# EAGLE board SDA390V1 (EAGLE 9.6.2), part 1 of 5
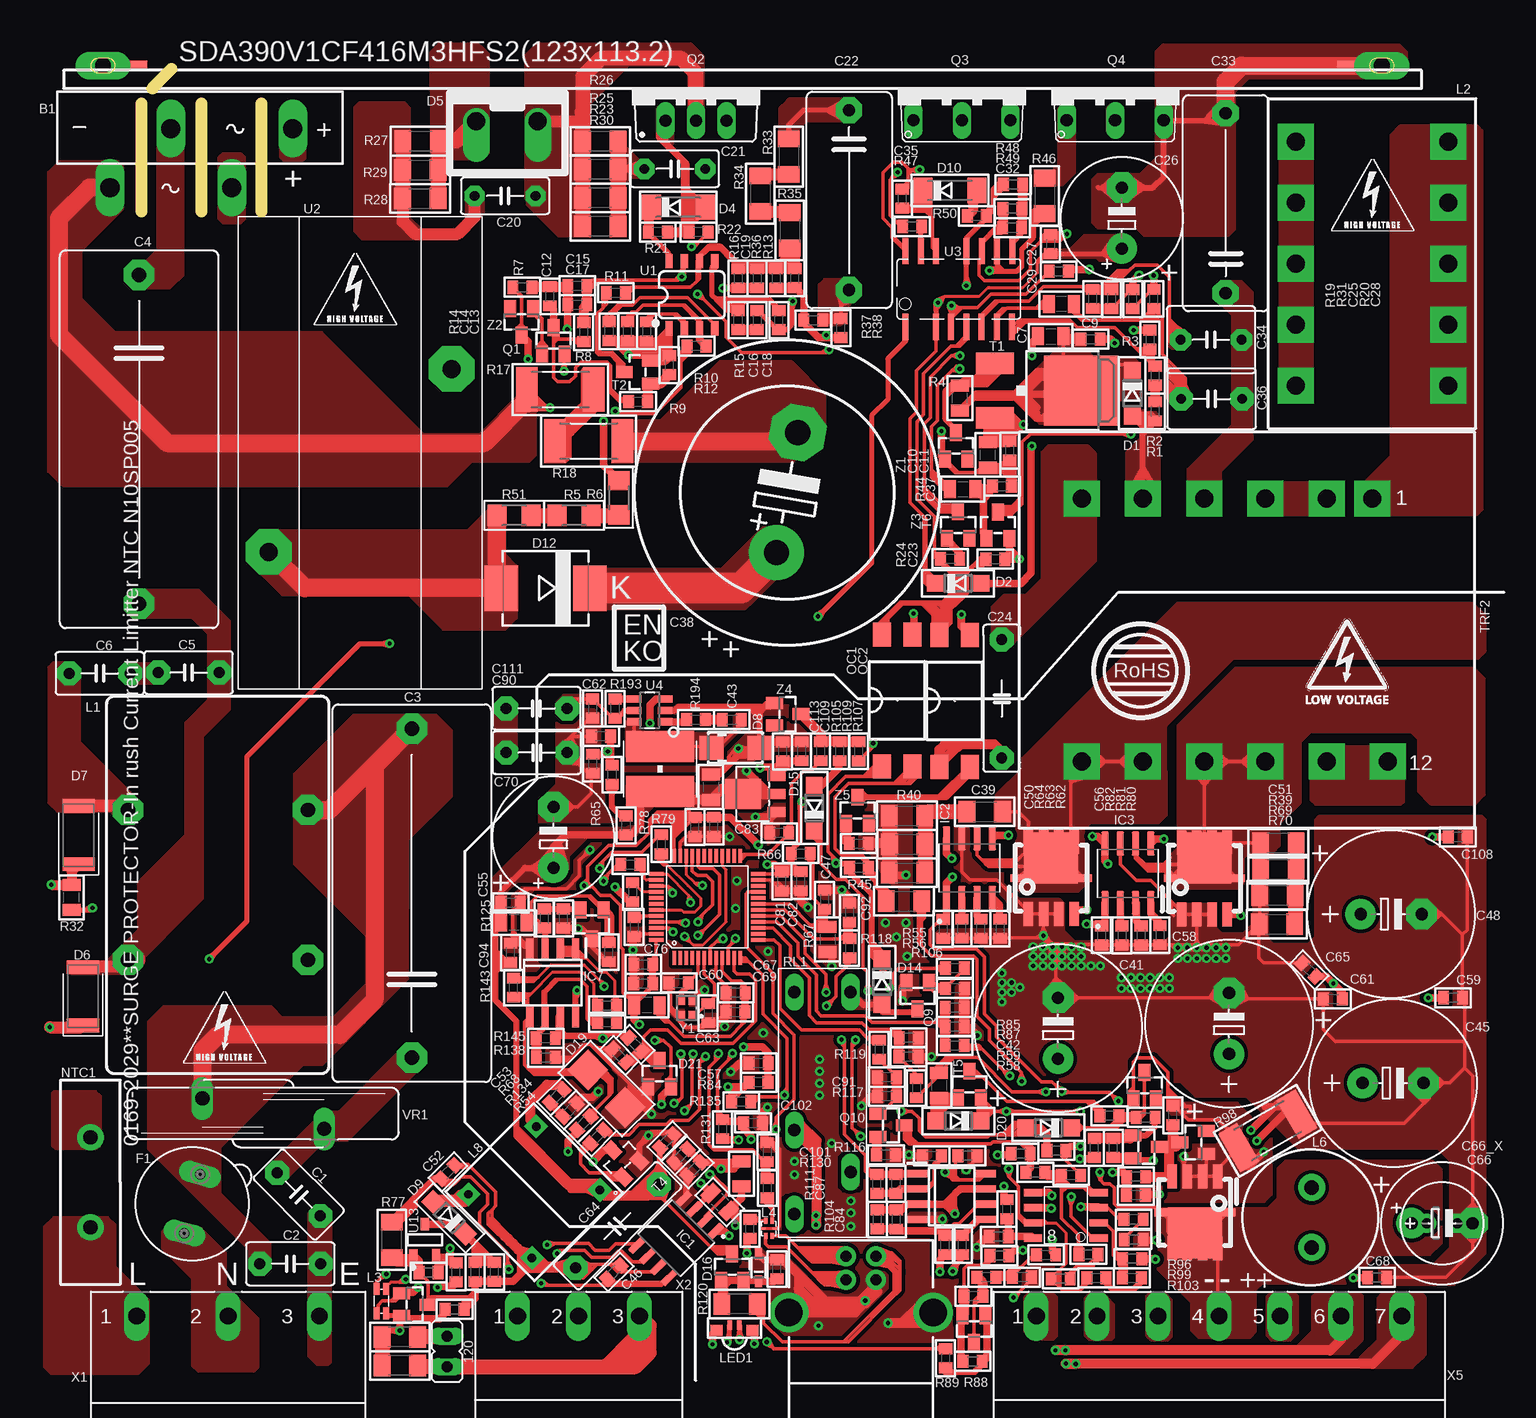
[diagram p5: board, top side]
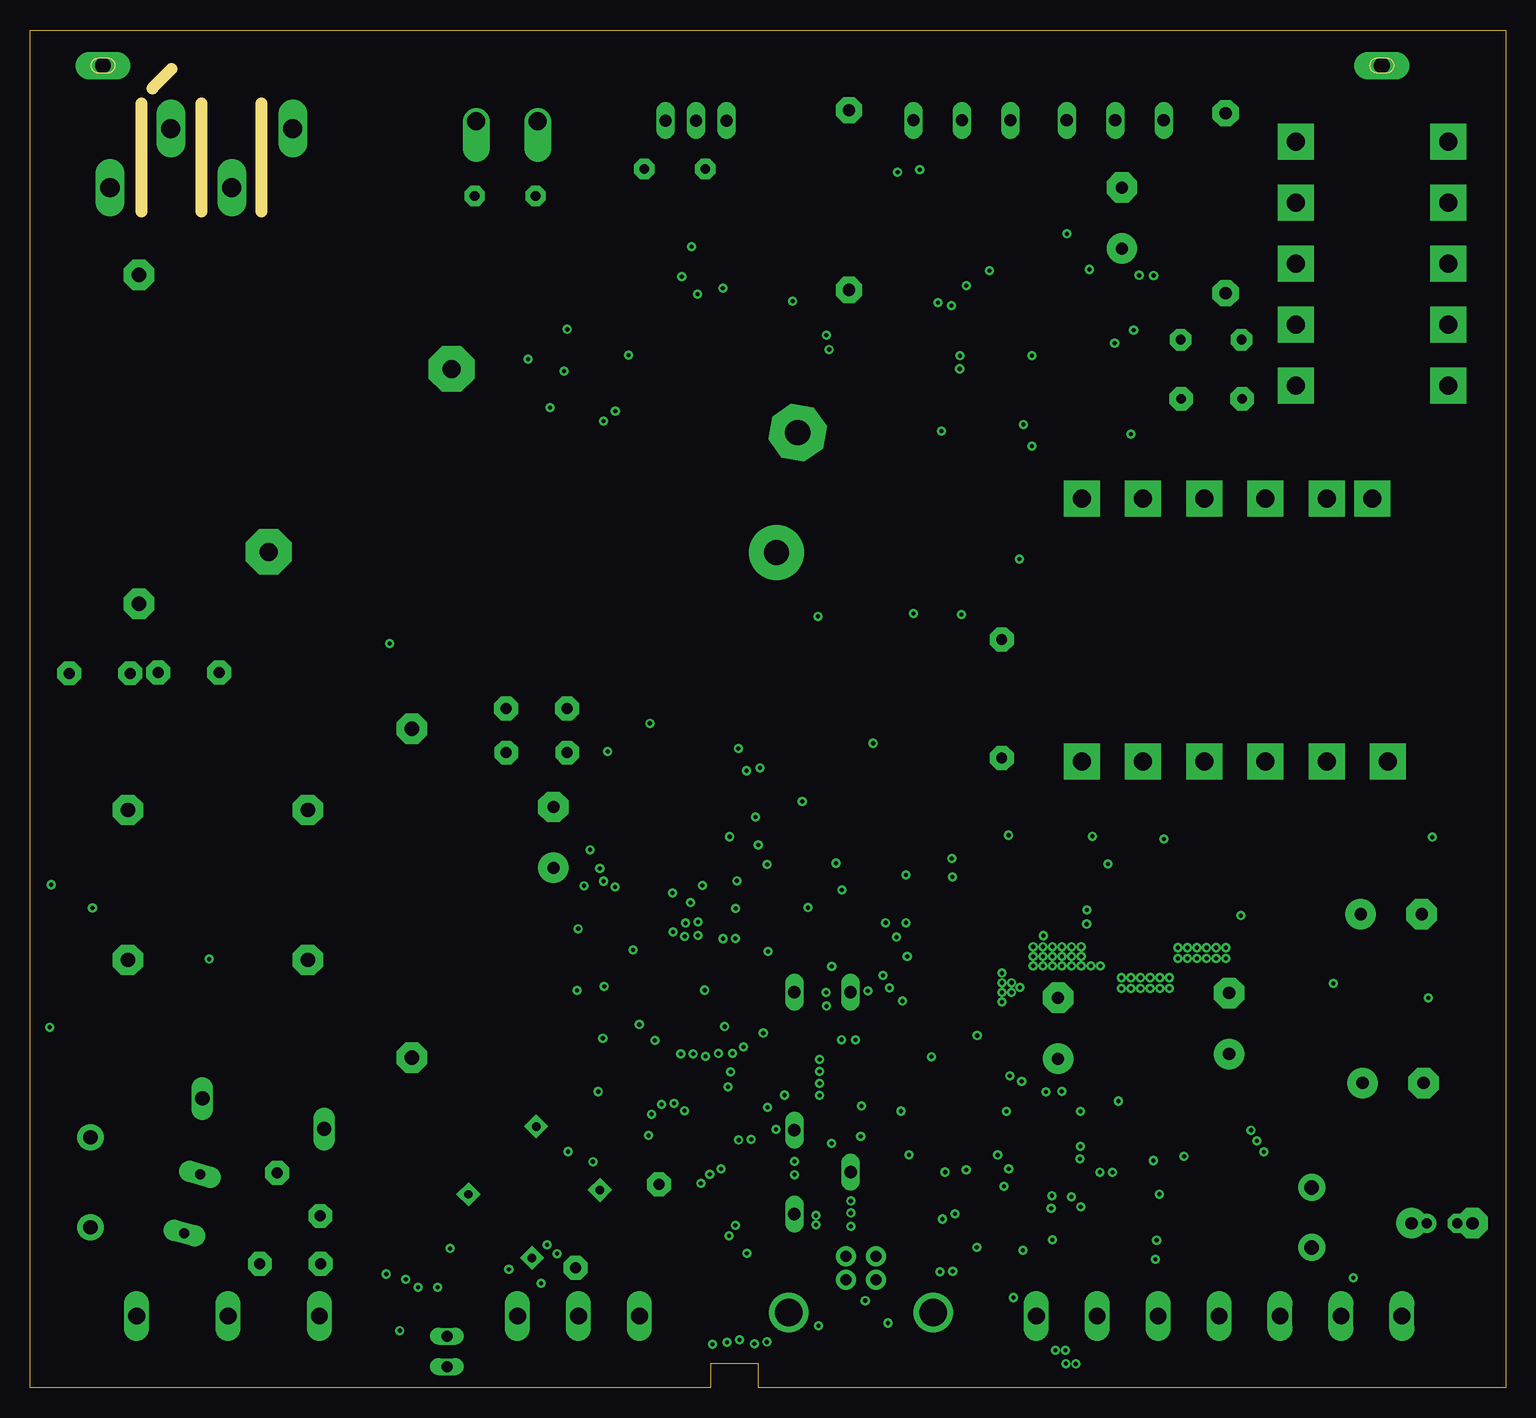
[diagram p6: board, inner layer Route3]
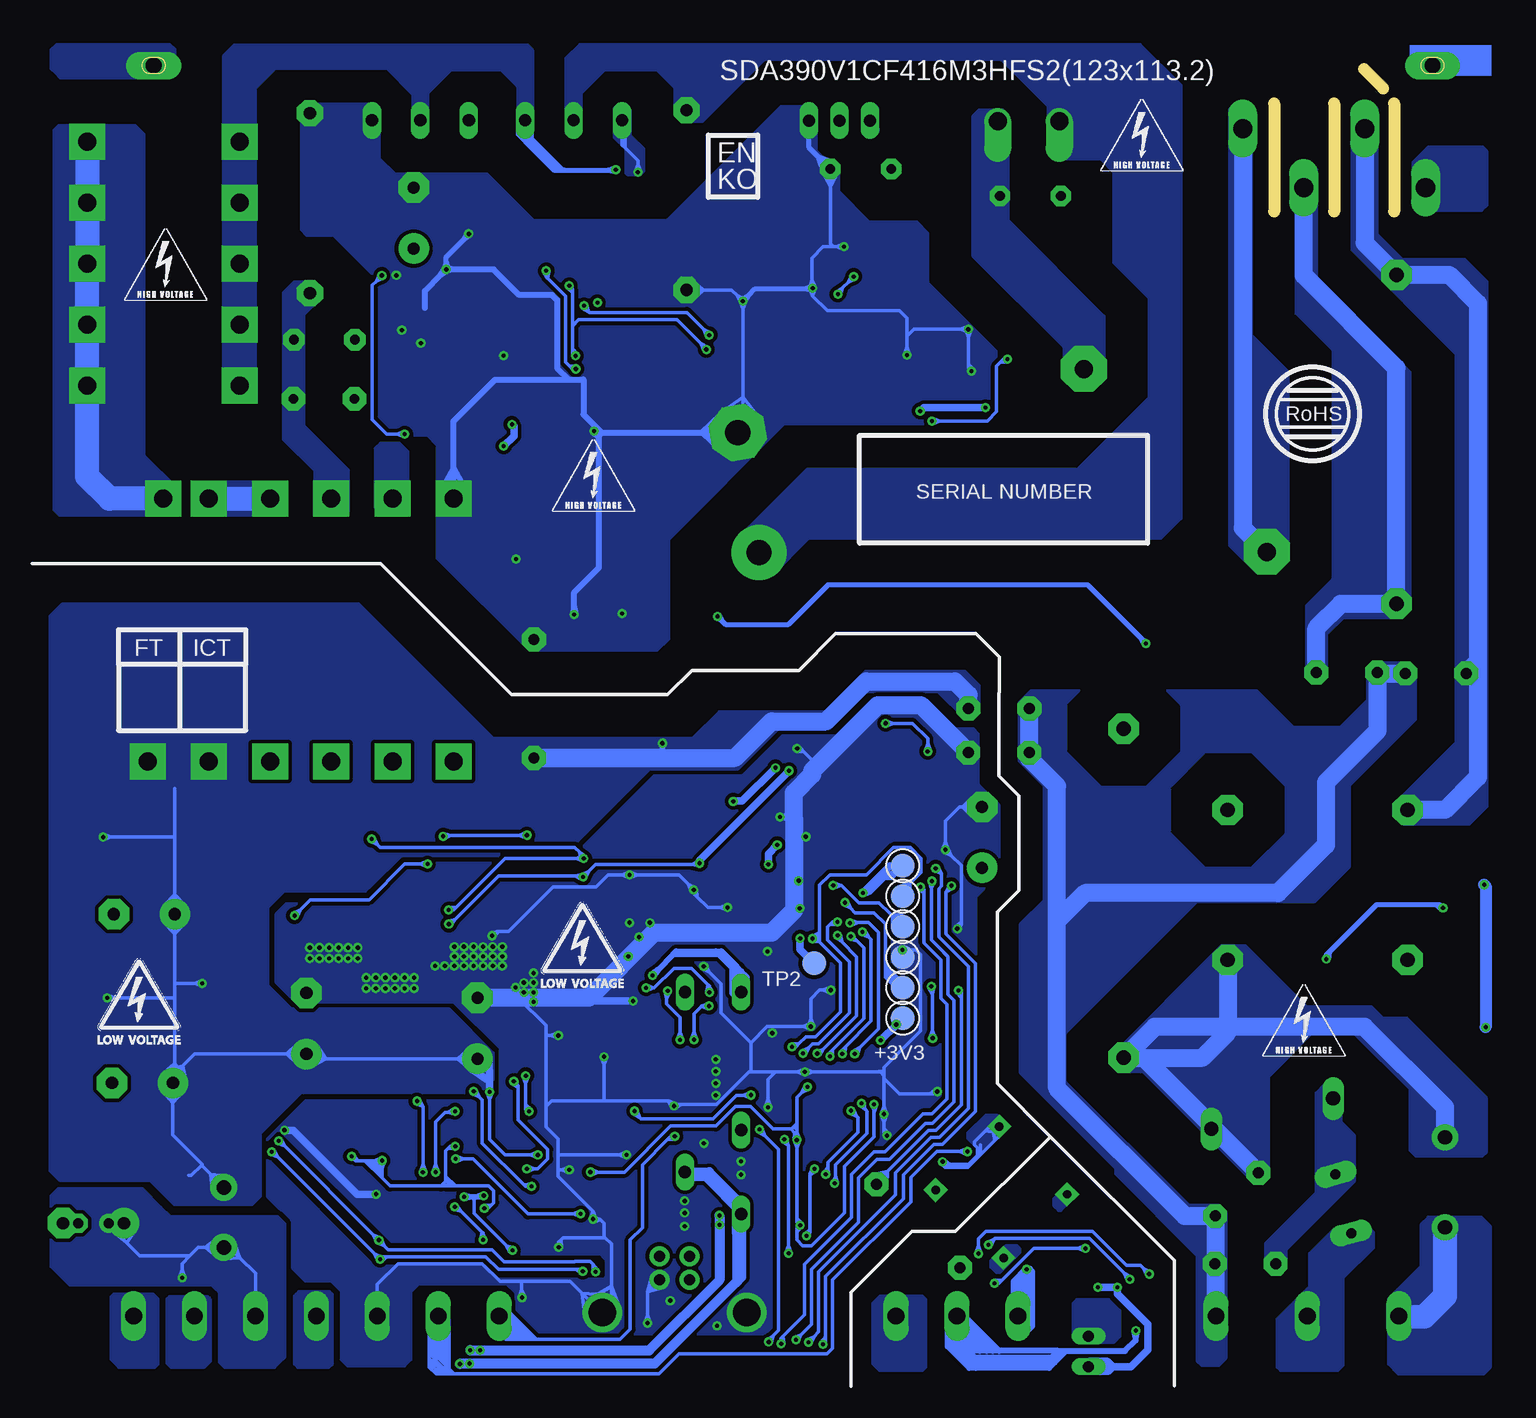
[diagram p7: board, bottom side, seen from below]

No outline drawn. Coordinates in mm, seen from the top.
Copper layers (1*3*16): Top 0.035mm / dielectric 1.53mm / Route3 0mil / dielectric 0mil / Bottom 0.035mm
Design rules "default *": minimum track width 6mil, minimum drill 0.35mm, track to track 11mil, track to pad 11mil, pad to pad 11mil, via to via 11mil, smd to smd 11mil, copper to edge 40mil, drill to drill 6mil, minimum pad ring 10mil, minimum via ring 8mil, stop-mask expansion 4mil, vias tented up to drill 0.35mm, thermal gap 10mil
Milling: 1 lines

## Footprints (pad centres in the part's own frame; a part is rotated, then mirrored left to right if it is on the bottom)
DıODE_BRIDGE_8A_DIK = drill 1.6 long: + -7.62,0.08; - 7.62,5; AC1 -2.54,5; AC2 2.54,0.08
C050-035X075 = drill 0.914 pad 1.981 octagon: 1 -2.54,0; 2 2.54,0
C275-134X316 = drill 1.194 pad 2.54 octagon: 1 -13.716,0; 2 13.716,0
C0805_ENKO = smd 1 x 1.5: 1 -1.052,0; 2 1.052,0
C0603_ENKO = smd 0.9 x 1.1: 1 -0.794,0; 2 0.794,0
C050-030X075 = drill 0.813 pad 1.676 octagon: 1 -2.54,0; 2 2.54,0
C150-072X183 = drill 1.016 pad 2.184 octagon: 1 -7.493,0; 2 7.493,0
C075-32X103_DEIF = drill 0.914 pad 2 octagon: P$1 -4.92,0; P$2 4.92,0
E5-10,5 = drill 1.016 pad 2.54: + -2.54,0 | drill 1.016 pad 2.54 octagon: - 2.54,0
C050-055X075 = drill 0.813 pad 1.778 octagon: 1 -2.54,0; 2 2.54,0
C050-050X075 = drill 0.813 pad 1.93 octagon: 1 -2.54,0; 2 2.54,0
EB25D = drill 2.1 pad 4.597: + -5.08,0 | drill 2.1 pad 4.597 octagon: - 5.08,0
C1206_ENKO = smd 1.4 x 1.8: 1 -1.479,0; 2 1.479,0
E5-13 = drill 1.016 pad 2.54: + -2.54,0 | drill 1.016 pad 2.54 octagon: - 2.54,0
E2,5-7 = drill 0.813 pad 1.6: + -1.27,0 | drill 0.813 pad 1.6 octagon: - 1.27,0
SOD123 = smd 1.4 x 1.4: A 1.9,0; C -1.9,0
SOT23 = smd 1 x 1.4: 1 -0.95,-1.1; 2 0.95,-1.1; 3 0,1.1
SOD106-R = smd 1.6 x 2.1: A 2.25,0; C -2.25,0
DIODE_12A_1000V_TO220 = drill 1.5 pad 2.184 offset: A 1.27,-2.54; K 1.27,2.59
DIOMELF5024 = smd 1.156 x 2.69: 1 -2.43,0; 2 2.43,0
SMA = smd 2 x 2: A 2,0; C -2,0
SMC = smd 2.8 x 3.8: A 3.7,0; C -3.7,0
TRANSIL_SMB = smd 2.4 x 2.4: A 2.2,0; A1 -2.2,0
19560 = drill 0.813 pad 1.778 long: 1 -2.54,0; 2 2.54,0
FERRITE_BEAT_0805 = smd 1 x 1.5: 1 -1.052,0; 2 1.052,0
DEIF_SOGUTUCU_300W = drill 1.3 pad 2.3 long: 1 -54.49,1.15; 3 52.11,1.15 | smd 4.3 x 0.8: 2 -52.94,1.15; 4 50.56,1.15
ISO1044 = smd 1.55 x 0.59: 1 -2.725,1.905; 2 -2.725,0.635; 3 -2.725,-0.635; 4 -2.725,-1.905; 5 2.725,-1.905; 6 2.725,-0.635; 7 2.725,0.635; 8 2.725,1.905
NCP4306 = smd 1.97 x 0.6: 1 -2.475,1.905; 2 -2.475,0.635; 3 -2.475,-0.635; 4 -2.475,-1.905; 5 2.475,-1.905; 6 2.475,-0.635; 7 2.475,0.635; 8 2.475,1.905
SO-8 = smd 1.524 x 0.61: 1 -2.743,1.92; 2 -2.743,0.65; 3 -2.743,-0.62; 4 -2.743,-1.89; 5 2.743,-1.89; 6 2.743,-0.62; 7 2.743,0.65; 8 2.743,1.92
SO08 = smd 0.6 x 1.8: 1 -1.905,-2.8; 2 -0.635,-2.8; 3 0.635,-2.8; 4 1.905,-2.8; 5 1.905,2.8; 6 0.635,2.8; 7 -0.635,2.8; 8 -1.905,2.8
TL431_SOT23F = smd 1 x 1.4: A 0,1.2; C -0.95,-1.2; R 0.95,-1.2
TPH6R30ANL = smd 0.8 x 2: D 1.905,3; D1 0.635,3; D2 -0.635,3; D3 -1.905,3; GATE 1.905,-3; S -1.905,-3; S1 -0.635,-3; S2 0.635,-3 | smd 1.27 x 0.635: P$1 -2.75,0; P$2 2.75,0 | smd 4.5 x 4.25: P$3 0,1.7
SOT89 = smd 0.8 x 1.5: 1 -1.5,-1.75; 2 0,-1.75; 3 1.5,-1.75 | smd 2.5 x 3: 4 0,1.05
JP1 = drill 0.914 long: 1 0,-1.27; 2 0,1.27
EPCOS_B82724J = drill 1.2 pad 2.54 octagon: 1 -7.5,-6.25; 2 -7.5,6.25; 3 7.5,6.25; 4 7.5,-6.25
E25/13/7 = drill 1.5 pad 3 square: 1 -6.35,10.16; 2 -6.35,5.08; 3 -6.35,0; 4 -6.35,-5.08; 5 -6.35,-10.16; 6 6.35,-10.16; 7 6.35,-5.08; 8 6.35,0; 9 6.35,5.08; 10 6.35,10.16
ACM2012-900--2P-T002 = smd 1 x 0.5: 1 -1.02,0.4; 2 -1.02,-0.4; 3 1.02,-0.4; 4 1.02,0.4
EXC24CS_COMMON_MODE = smd 0.4 x 0.2: 1 -0.5,0; 4 0.5,0 | smd 0.3 x 0.5: 2 -0.275,-0.625; 3 0.275,-0.625; 5 0.275,0.625; 6 -0.275,0.625
WE-PD2_5MM = smd 2.55 x 5.7: 1 -1.875,0; 2 1.875,0
INDUCTOR-NEOSID = drill 1.2 pad 2.25: 1 -2.5,0.1; 2 2.5,0.1
EE10_V_4+4 = drill 0.7 pad 1.422 square: 1 -4,3.75; 4 -4,-3.75; 5 4,-3.75; 8 4,3.75
KPFA-3010RGBC-11 = smd 1 x 0.9: 1 1.5,-0.2; 2 -1.5,-0.2 | smd 0.4 x 0.8: 3 -0.4,0.25; 4 0.4,0.25
SENS_NTC = drill 1.2 pad 2.184: P$1 3.75,0; P$2 -3.75,0
PS2561DL2-1_OPTO1 = smd 1.5 x 2: 1 -1.27,-5.5; 2 1.27,-5.5; 3 1.27,5.5; 4 -1.27,5.5
PROG_6PIN = smd 2 x 2: 1 0,6.35; 2 0,3.81; 3 0,1.27; 4 0,-1.27; 5 0,-3.81; 6 0,-6.35
TO220BV = drill 1.016 long: D 0,-2.54; G -2.54,-2.54; S 2.54,-2.54
ISO_TO_220 = drill 1.016 long: 1 -4.04,-0.04; 2 0,-0.04; 3 4.04,-0.04
R0603_ENKO = smd 0.9 x 1.1: 1 -0.794,0; 2 0.794,0
R0805_ENKO = smd 1 x 1.5: 1 -1.052,0; 2 1.052,0
R1206 = smd 1.6 x 1.803: 1 -1.422,0; 2 1.422,0
R2512 = smd 1.8 x 3.7: 1 -2.8,0; 2 2.8,0
R1206_ENKO = smd 1.4 x 1.8: 1 -1.479,0; 2 1.479,0
ALD1_AND_ALJ_RELAY = drill 1.016 pad 1.27 long: 1 -8.997,-2.129; 2 -8.998,2.565; P0 9.505,-2.132; P1 6.007,2.571; S0 2.507,-2.129
DPAK = smd 1.8 x 3.2: 1 -2.28,-4.8; 3 2.28,-4.8 | smd 5.8 x 6.2: 4 0,2.38
SOT-23 = smd 1 x 1.4: 1 0,1.1; 2 0.95,-1.1; 3 -0.95,-1.1
SOT23-BEC = smd 1 x 1.4: B -0.95,-1.1; C 0,1.1; E 0.95,-1.1
TP20R = smd 2 x 2: TP 0,0
E34/14/9 = drill 1.5 pad 3 square: 1 -11.45,-10.95; 2 -7.65,-10.95; 3 -2.55,-10.95; 4 2.55,-10.95; 5 7.65,-10.95; 6 12.75,-10.95; 7 12.75,10.95; 8 7.65,10.95; 9 2.55,10.95; 10 -2.55,10.95; 11 -7.65,10.95; 12 -12.75,10.95
SOD323 = smd 1 x 0.6: A 1.143,0; C -1.143,0
UCC28180 = smd 0.6 x 1.2: 1 -1.905,-2.8; 2 -0.635,-2.8; 3 0.635,-2.8; 4 1.905,-2.8; 5 1.905,2.8; 6 0.635,2.8; 7 -0.635,2.8; 8 -1.905,2.8
IND_TOROID = drill 1.5 pad 3.81 octagon: 1 -7.62,7.62; 2 7.62,-7.62
SOIC16_UCC256301 = smd 0.5 x 2.2: 1 -4.445,-3.154; 3 -1.915,-3.154; 4 -0.645,-3.154; 5 0.635,-3.154; 6 1.895,-3.154; 7 3.165,-3.154; 8 4.435,-3.154; 9 4.445,3.154; 10 3.175,3.154; 11 1.905,3.154; 12 0.635,3.154; 14 -1.905,3.154; 15 -3.175,3.154; 16 -4.445,3.154
AOZ1282CI-1 = smd 1.2 x 0.6: 1 -1.298,0.95; 2 -1.298,0; 3 -1.298,-0.95; 4 1.298,-0.95; 5 1.298,0; 6 1.298,0.95
STM32F072CXXX_LQFP48 = smd 0.3 x 1.2: 1 -2.75,-4.25; 2 -2.25,-4.25; 3 -1.75,-4.25; 4 -1.25,-4.25; 5 -0.75,-4.25; 6 -0.25,-4.25; 7 0.25,-4.25; 8 0.75,-4.25; 9 1.25,-4.25; 10 1.75,-4.25; 11 2.25,-4.25; 12 2.75,-4.25; 25 2.75,4.25; 26 2.25,4.25; 27 1.75,4.25; 28 1.25,4.25; 29 0.75,4.25; 30 0.25,4.25; 31 -0.25,4.25; 32 -0.75,4.25; 33 -1.25,4.25; 34 -1.75,4.25; 35 -2.25,4.25; 36 -2.75,4.25 | smd 1.2 x 0.3: 13 4.25,-2.75; 14 4.25,-2.25; 15 4.25,-1.75; 16 4.25,-1.25; 17 4.25,-0.75; 18 4.25,-0.25; 19 4.25,0.25; 20 4.25,0.75; 21 4.25,1.25; 22 4.25,1.75; 23 4.25,2.25; 24 4.25,2.75; 37 -4.25,2.75; 38 -4.25,2.25; 39 -4.25,1.75; 40 -4.25,1.25; 41 -4.25,0.75; 42 -4.25,0.25; 43 -4.25,-0.25; 44 -4.25,-0.75; 45 -4.25,-1.25; 46 -4.25,-1.75; 47 -4.25,-2.25; 48 -4.25,-2.75
AP2210N-5.0TRG1_SOT23-3 = smd 1.05 x 0.7: 1 -1.3,0.95; 2 -1.3,-0.95; 3 1.3,0
S20K40 = drill 1.194 long: 1 -1.27,-5.08; 2 1.27,5.08
GMSTBA3 = drill 1.397 long: 1 -7.62,5.08; 2 0,5.08; 3 7.62,5.08
MSTBA3 = drill 1.397 long: 1 -5.08,5.08; 2 0,5.08; 3 5.08,5.08
MSTBA7 = drill 1.397 long: 1 -15.24,5.08; 2 -10.16,5.08; 3 -5.08,5.08; 4 0,5.08; 5 5.08,5.08; 6 10.16,5.08; 7 15.24,5.08
USB_B(YATIK) = drill 0.914 pad 1.676: D+ 4,1.25; D- 5.981,1.25; GND 4,-1.25; VBUS 5.981,-1.25 | drill 2.286: SHLD1 1.282,-6.02; SHLD2 1.282,6.02
NX2016SA-32M = smd 0.85 x 0.75: 1 -0.675,-0.525; 2 0.675,-0.525; 3 0.675,0.525; 4 -0.675,0.525

## Placement (x,y rotation side)
B1  0119-1152**DIODE BRIDGE 8A 800V 4-SIP, GBU  [DıODE_BRIDGE_8A_DIK]  -108.72,105.06 180 top
C1  NC**Takılmayacak  [C050-035X075]  -100.59,16.13 315 top
C2  NC**Takılmayacak  [C050-035X075]  -101.3,10.35 0 top
C3  0019-2209**CAP TH POLY 2.2uF 305Vac %10 X2 Metalize PP F=27.5mm (32x25x13)  [C275-134X316]  -91.17,41.24 90 top
C4  0019-2209**CAP TH POLY 2.2uF 305Vac %10 X2 Metalize PP F=27.5mm (32x25x13)  [C275-134X316]  -113.91,79.08 270 top
C5  0019-1391**CAP TH CER 4700pF 250VAC 2.5kVDC X1Y2 %20 85C F=5mm  [C050-035X075]  -109.78,59.63 180 top
C6  0019-1391**CAP TH CER 4700pF 250VAC 2.5kVDC X1Y2 %20 85C F=5mm  [C050-035X075]  -117.18,59.57 0 top
C7  1019-3243**CAP 0805 CER 10uF 50V ±10% X5R -55°C ~ 85°C  [C0805_ENKO]  -37.91,87.66 0 top
C8  1200920268**CAP 0603 CER 100nF 50V %10 X7R  [C0603_ENKO]  -49.76,29.19 0 top
C9  NC**TAKILMAYACAK  [C0603_ENKO]  -34.59,87.42 180 top
C10  1019-3243**CAP 0805 CER 10uF 50V ±10% X5R -55°C ~ 85°C  [C0805_ENKO]  -43.14,77.78 90 top
C11  1200920268**CAP 0603 CER 100nF 50V %10 X7R  [C0603_ENKO]  -41.33,78.13 90 top
C12  1200920567**CAP 0603 CER 1uF 25V %10X7R  [C0603_ENKO]  -79.66,91 90 top
C13  1409-0021**CAP 0603 CER 2.2nf 50V %10 X7R  [C0603_ENKO]  -71.6,88.07 270 top
C14  1019-3157**CAP 0603 CER 1.5nF 50V %10 X7R (AbC)  [C0603_ENKO]  -73.2,88.09 270 top
C15  1200920268**CAP 0603 CER 100nF 50V %10 X7R  [C0603_ENKO]  -77.38,91.87 180 top
C16  1200920558**CAP 0603 CER 10u 25V %20 X5R  [C0603_ENKO]  -62.39,89.01 90 top
C17  1200920558**CAP 0603 CER 10u 25V %20 X5R  [C0603_ENKO]  -77.38,90.3 180 top
C18  1200920567**CAP 0603 CER 1uF 25V %10X7R  [C0603_ENKO]  -60.58,89.01 270 top
C19  1200920095**CAP 0805 CER 560pF 50V %20 X7R  [C0603_ENKO]  -62.38,92.49 270 top
C20  NC**Takılmayacak  [C050-030X075]  -83.39,99.37 180 top
C21  NC**Takılmayacak  [C050-030X075]  -69.25,101.62 180 top
C22  1200920389**CAP TH POLY 150nF 305 Vac %20 X2 105C F=15mm  [C150-072X183]  -54.72,99.02 270 top
C23  1019-3167**CAP 0603 CER 10nF 50V %10 X7R (AbC)  [C0603_ENKO]  -42.53,69.08 0 top
C24  0019-1391**CAP TH CER 4700pF 250VAC 2.5kVDC X1Y2 %20 85C F=5mm  [C075-32X103_DEIF]  -42,57.45 270 top
C25  1019-3167**CAP 0603 CER 10nF 50V %10 X7R (AbC)  [C0603_ENKO]  -32.84,90.77 270 top
C26  1200920196**CAP TH AL. ELEC 470uF 35V %20 105C SSZ F=5/10X16  [E5-10,5]  -31.98,97.52 90 top
C27  1200920268**CAP 0603 CER 100nF 50V %10 X7R  [C0603_ENKO]  -37.92,95.35 90 top
C28  1019-3167**CAP 0603 CER 10nF 50V %10 X7R (AbC)  [C0603_ENKO]  -29.32,90.78 90 top
C29  1019-3167**CAP 0603 CER 10nF 50V %10 X7R (AbC)  [C0603_ENKO]  -37.24,93.09 180 top
C30  1019-3362**CAP 0603 CER 2.2uF 10V %10 X5R  [C0603_ENKO]  -85.89,9.66 270 top
C31  1019-3362**CAP 0603 CER 2.2uF 10V %10 X5R  [C0603_ENKO]  -84.29,9.67 270 top
C32  1019-3167**CAP 0603 CER 10nF 50V %10 X7R (AbC)  [C0603_ENKO]  -41.12,96.72 180 top
C33  0019-1345**CAP TH POLY 10nF 600VAC 1000VDC MKP %5 85C F=15/5x11x18 (AbC)  [C150-072X183]  -23.33,98.76 90 top
C34  0019-5004**CAP TH CER 100pF 1kV Y5V %10 85C F=5  [C050-055X075]  -24.55,87.38 180 top
C35  1019-3367**CAP 0603 CER 10uF 25VDC ±20% X5R -55°C ~ +85°C  [C0603_ENKO]  -50.29,99.13 270 top
C36  0019-5004**CAP TH CER 100pF 1kV Y5V %10 85C F=5  [C050-050X075]  -24.5,82.45 180 top
C37  1200920567**CAP 0603 CER 1uF 25V %10X7R  [C0603_ENKO]  -41.97,75.17 0 top
C38  0019-3039**150uF 450V 105C %20 Ba:10 Yu: 41,5 çap: 25  [EB25D]  -59.89,74.64 80 top
C39  NC**Takılmayacak  [C1206_ENKO]  -43.41,48.03 180 top
C40  1200920253**CAP 0603 CER 10n 50V%10 X7R  [C0603_ENKO]  -68.73,19.37 45 top
C41  0019-3046**CAP TH AL ELEC 1000uF 35V %20 105C F=5/12.5x25 LOW ESR  [E5-13]  -37.3,29.98 90 top
C42  1200920268**CAP 0603 CER 100nF 50V %10 X7R  [C0603_ENKO]  -45.91,31.71 0 top
C43  1200920268**CAP 0603 CER 100nF 50V %10 X7R  [C0603_ENKO]  -64.5,55.71 0 top
C44  1200920268**CAP 0603 CER 100nF 50V %10 X7R  [C0603_ENKO]  -67.62,18.25 45 top
C45  0019-3046**CAP TH AL ELEC 1000uF 35V %20 105C F=5/12.5x25 LOW ESR  [E5-13]  -9.37,25.42 0 top
C46  1200920268**CAP 0603 CER 100nF 50V %10 X7R  [C0603_ENKO]  -74.32,9.66 225 top
C47  1200920268**CAP 0603 CER 100nF 50V %10 X7R  [C0603_ENKO]  -56.77,40.69 90 top
C48  0019-3046**CAP TH AL ELEC 1000uF 35V %20 105C F=5/12.5x25 LOW ESR  [E5-13]  -9.53,39.49 0 top
C49  1200920271**CAP 0603 CER 10pF 50V%10 COG  [C0603_ENKO]  -75.4,54.32 180 top
C50  1200920567**CAP 0603 CER 1uF 25V %10X7R  [C0603_ENKO]  -46.87,38.27 90 top
C51  NC**Takılmayacak  [C1206_ENKO]  -18.94,45.42 0 top
C52  1200920253**CAP 0603 CER 10n 50V%10 X7R  [C0603_ENKO]  -88.16,18 45 top
C53  NC**Takılmayacak  [C0603_ENKO]  -79.1,24.32 225 top
C54  1019-3243**CAP 0805 CER 10uF 50V ±10% X5R -55°C ~ 85°C  [C0805_ENKO]  -66.24,50.08 270 top
C55  1200920252**CAP 0603 CER 1nF 50V %10 X7R  [C0603_ENKO]  -82.92,40.45 180 top
C56  1200920567**CAP 0603 CER 1uF 25V %10X7R  [C0603_ENKO]  -33.67,37.73 90 top
C57  1200920268**CAP 0603 CER 100nF 50V %10 X7R  [C0603_ENKO]  -62.26,27.07 0 top
C58  0019-3046**CAP TH AL ELEC 1000uF 35V %20 105C F=5/12.5x25 LOW ESR  [E5-13]  -23.05,30.39 90 top
C59  1200920268**CAP 0603 CER 100nF 50V %10 X7R  [C0603_ENKO]  -4.38,32.53 0 top
C60  1019-3352**CAP 0603 CER 22pF 50V %5 NPO  [C0603_ENKO]  -68.93,33.76 180 top
C61  1200920268**CAP 0603 CER 100nF 50V %10 X7R  [C0603_ENKO]  -14.39,32.42 180 top
C62  1200920268**CAP 0603 CER 100nF 50V %10 X7R  [C0603_ENKO]  -76.1,56.65 90 top
C63  1019-3352**CAP 0603 CER 22pF 50V %5 NPO  [C0603_ENKO]  -66.46,31.24 270 top
C64  1200920067**CAP TH CER 2.2nF 250Vac %20 X1Y2 F=5mm FORMLU  [C075-32X103_DEIF]  -74.06,13.49 225 top
C65  1200920268**CAP 0603 CER 100nF 50V %10 X7R  [C0603_ENKO]  -16.39,34.85 135 top
C66  1200920196**CAP TH AL. ELEC 470uF 35V %20 105C SSZ F=5/10X16  [E5-10,5]  -5.29,13.73 0 top
C66_X  NC**Takılmayacak  [E2,5-7]  -5.29,13.73 0 top
C67  1200920268**CAP 0603 CER 100nF 50V %10 X7R  [C0603_ENKO]  -64.18,32.93 180 top
C68  1200920268**CAP 0603 CER 100nF 50V %10 X7R  [C0603_ENKO]  -10.71,9.21 0 top
C69  1019-3167**CAP 0603 CER 10nF 50V %10 X7R (AbC)  [C0603_ENKO]  -64.2,31.34 180 top
C70  1200920196**CAP TH AL. ELEC 470uF 35V %20 105C SSZ F=5/10X16  [E5-10,5]  -79.36,45.89 90 top
C76  1200920268**CAP 0603 CER 100nF 50V %10 X7R  [C0603_ENKO]  -71.88,35.29 180 top
C77  1019-3167**CAP 0603 CER 10nF 50V %10 X7R (AbC)  [C0603_ENKO]  -71.88,33.7 180 top
C78  1019-3387**CAP 0603 CER 10uF 10V %10 X5R  [C0603_ENKO]  -40.3,9.24 180 top
C79  1200920268**CAP 0603 CER 100nF 50V %10 X7R  [C0603_ENKO]  -44.86,19.35 0 top
C80  1200920268**CAP 0603 CER 100nF 50V %10 X7R  [C0603_ENKO]  -42.25,12.62 0 top
C81  1019-3167**CAP 0603 CER 10nF 50V %10 X7R (AbC)  [C0603_ENKO]  -60.33,42.22 270 top
C82  1200920268**CAP 0603 CER 100nF 50V %10 X7R  [C0603_ENKO]  -58.74,42.24 270 top
C83  1019-3167**CAP 0603 CER 10nF 50V %10 X7R (AbC)  [C0603_ENKO]  -60.55,46.27 180 top
C84  NC**TAKILMAYACAK (Not Fitted)  [C0603_ENKO]  -50.79,14.04 90 top
C85  1200920567**CAP 0603 CER 1uF 25V %10X7R  [C0603_ENKO]  -34.11,9.17 180 top
C86  1200920567**CAP 0603 CER 1uF 25V %10X7R  [C0603_ENKO]  -37.09,9.1 180 top
C87  1200920371**CAP 0603 CER 150p 50V%5 COG  [C0603_ENKO]  -50.81,17.01 90 top
C88  1019-3167**CAP 0603 CER 10nF 50V %10 X7R (AbC)  [C0603_ENKO]  -67.57,46.76 270 top
C89  1200920268**CAP 0603 CER 100nF 50V %10 X7R  [C0603_ENKO]  -66,46.77 270 top
C90  0019-1391**CAP TH CER 4700pF 250VAC 2.5kVDC X1Y2 %20 85C F=5mm  [C050-035X075]  -80.76,52.96 0 top
C91  1019-3387**CAP 0603 CER 10uF 10V %10 X5R  [C0603_ENKO]  -51.55,25.91 0 top
C92  1200920268**CAP 0603 CER 100nF 50V %10 X7R  [C0603_ENKO]  -54.68,39.63 270 top
C93  1200920268**CAP 0603 CER 100nF 50V %10 X7R  [C0603_ENKO]  -60.74,9.9 90 top
C94  1200920268**CAP 0603 CER 100nF 50V %10 X7R  [C0603_ENKO]  -82.94,36.28 90 top
C98  1200920268**CAP 0603 CER 100nF 50V %10 X7R  [C0603_ENKO]  -30.8,16.07 180 top
C99  1200920268**CAP 0603 CER 100nF 50V %10 X7R  [C0603_ENKO]  -69.92,20.59 45 top
C100  1200920268**CAP 0603 CER 100nF 50V %10 X7R  [C0603_ENKO]  -74.74,36.32 90 top
C101  1019-3381**CAP 0603 CER 33pf 50V %5 NPO(COG)  [C0603_ENKO]  -61.55,19.66 90 top
C102  1019-3381**CAP 0603 CER 33pf 50V %5 NPO(COG)  [C0603_ENKO]  -62.73,22.08 0 top
C103  1200920268**CAP 0603 CER 100nF 50V %10 X7R  [C0603_ENKO]  -37.44,19.79 0 top
C107  1200920268**CAP 0603 CER 100nF 50V %10 X7R  [C0603_ENKO]  -73.86,27.71 315 top
C108  1019-3167**CAP 0603 CER 10nF 50V %10 X7R (AbC)  [C0603_ENKO]  -3.98,45.93 180 top
C109  1200920268**CAP 0603 CER 100nF 50V %10 X7R  [C0603_ENKO]  -58.67,53.08 90 top
C111  0019-1391**CAP TH CER 4700pF 250VAC 2.5kVDC X1Y2 %20 85C F=5mm  [C050-035X075]  -80.77,56.65 180 top
C113  1019-3375**CAP 0603 CER 22uF 10V %20 X5R  [C0603_ENKO]  -60.26,53.06 90 top
C134  1019-3362**CAP 0603 CER 2.2uF 10V %10 X5R  [C0603_ENKO]  -89.77,9.62 180 top
D1  1200980377**DIODE SWITCHING SMD 75V 200mA SOD-123 1N4148W  [SOD123]  -31.11,82.92 270 top
D2  1200980377**DIODE SWITCHING SMD 75V 200mA SOD-123 1N4148W  [SOD123]  -45.64,67.07 0 top
D3  1119-3034**ESD Protection Diode for CANBUS NXP PESD2CAN SOT23  [SOT23]  -90.93,6.95 270 top
D4  NC**Takılmayacak  [SOD106-R]  -68.96,98.42 0 top
D5  0119-5001**Diode SIC Schottky 600V 4A TO220-2 C3D04060A  [DIODE_12A_1000V_TO220]  -83.21,104.32 90 top
D6  1200980002**DIODE RECTIFIER SMD 1000V 1A SM4007  [DIOMELF5024]  -118.59,32.65 90 top
D7  1200980002**DIODE RECTIFIER SMD 1000V 1A SM4007  [DIOMELF5024]  -118.94,46.09 90 top
D8  1200980432**DIODE SCHOTTKY RECTIFIER SMD SMA/DO_214AC 60V 2A STPS2L60A  [SMA]  -64.2,53.36 0 top
D9  1200980377**DIODE SWITCHING SMD 75V 200mA SOD-123 1N4148W  [SOD123]  -88.05,14.17 135 top
D10  1200980554**DIODE SWITCHING SM 1000V 1A US1M  [SOD106-R]  -46.31,99.82 0 top
D12  1119-3040**800V 8A SMC DIODE S8KC-13 Diodes (AbC) (MX322)  [SMC]  -80.02,66.67 180 top
D14  1200980377**DIODE SWITCHING SMD 75V 200mA SOD-123 1N4148W  [SOD123]  -51.97,33.85 270 top
D15  1200980377**DIODE SWITCHING SMD 75V 200mA SOD-123 1N4148W  [SOD123]  -57.62,48.34 90 top
D16  1119-3027**DIODE 75V 200MA SOT23 BAS16 (AbC)  [SOT23]  -64.46,10.09 0 top
D18  1200980377**DIODE SWITCHING SMD 75V 200mA SOD-123 1N4148W  [SOD123]  -38.09,21.69 180 top
D19  1119-3072**DIODE TVS 600W 12V DO214AA BIPOLAR  [TRANSIL_SMB]  -74.94,24.95 135 top
D20  1200980377**DIODE SWITCHING SMD 75V 200mA SOD-123 1N4148W  [SOD123]  -45.61,22.25 180 top
D21  1200980593**DIODE SCHOTTKY BARRIER DOUBLE SMD 30V 200mA BAT54S  [SOT23]  -70.53,26.2 0 top
F1  0169-2042**SIGORTA 5A FAST-ACTING TR5 SERISI SILINDIRIK TIP  [19560]  -109.48,15.35 75 top
FB1  1319-4060**Ferrite Bead SMD 0805 2kOhm@100MHz 300mA LAIRD HZ0805C202R-10  [FERRITE_BEAT_0805]  -63.7,17.84 90 top
H3  [DEIF_SOGUTUCU_300W]  -62.42,109.09 0 top
IC1  1039-2381**ISO1044 Isolated CAN FD Transceiver 8-SOIC(D)  [ISO1044]  -69.12,12.48 225 top
IC2  1039-9013**NCP4306AADZZZADR2G SOIC-8 (senkron IC) Synchronous Rectification Controller for Flyback  [NCP4306]  -44.69,43.34 90 top
IC3  1039-9013**NCP4306AADZZZADR2G SOIC-8 (senkron IC) Synchronous Rectification Controller for Flyback  [NCP4306]  -31.48,42.91 90 top
IC4  1039-2224**TSM1011ID SO-8 Constant Voltage and Constant Current Controller  [SO-8]  -36.65,14.4 180 top
IC5  1039-2009**OPAMP 3-32 V Dual 70C SO8 LM358  [SO08]  -46.17,15.96 270 top
IC6  1200980448**IC REGULATOR VOLTAGE SMD ZTL431AFFTA 2.5V %1  [TL431_SOT23F]  -76.15,38.64 180 top
IC7  1039-2009**OPAMP 3-32 V Dual 70C SO8 LM358  [SO08]  -79.43,33.77 180 top
IC8  1109-4211**Mosfet N-Ch 100V 90A Rds:3.7mR 8-SOP Advance (5x5) TPH3R70APL  [TPH6R30ANL]  -25.9,14.63 180 top
IC9  1039-3003**Voltage Regulator SOT-89 3.3V Diodes AP2204RA-3.3TRG1  [SOT89]  -62.51,49.51 90 top
IC10  1109-4211**Mosfet N-Ch 100V 90A Rds:3.7mR 8-SOP Advance (5x5) TPH3R70APL  [TPH6R30ANL]  -25.11,42.48 0 top
IC11  1109-4211**Mosfet N-Ch 100V 90A Rds:3.7mR 8-SOP Advance (5x5) TPH3R70APL  [TPH6R30ANL]  -37.88,42.5 0 top
JP2  [JP1]  -88.24,3.05 0 top
L1  0319-7034**LINE FILTER 2x3.3mH 6A common mode choke  [EPCOS_B82724J]  -107.35,41.93 180 top
L2  Stok Dışı - E24/13/7 126uH  [E25/13/7]  -11.12,93.73 0 top
L3  1319-4002**ACM2012 SMD Common Mode Filter  [ACM2012-900--2P-T002]  -93.7,7.24 270 top
L4  1319-4100**EXC24 Common Mode Noise Filters with ESD Suppressor(0504 Size)  [EXC24CS_COMMON_MODE]  -61.41,13.29 0 top
L5  1319-4102**INDUCTOR POWER 22UH 4X4X1.8MM SMD  [WE-PD2_5MM]  -70.48,51.6 90 top
L6  0319-1713**1210 DC choke  [INDUCTOR-NEOSID]  -16.26,14.21 270 top
L8  031-XXXX*EE10 Vertical Pulse Trafosu(1/1.3)  [EE10_V_4+4]  -80.97,16.32 225 top
LED1  1209-0011**LED, RGB, Red, Green, Blue, SMD, 1mm x 3mm, 120 °, Dome, R 20mA, G 20mA, B 20mA (Right Angle)  [KPFA-3010RGBC-11]  -64.27,5 0 top
NTC1  0169-2029**SURGE PROTECTOR-In rush Current Limitter NTC N10SP005  [SENS_NTC]  -117.96,17.14 90 top
OC1  1200980560**OPTOCOUPLER SMD PS2561DL2-1Y-V-F3-A/L CTR Rank:L  [PS2561DL2-1_OPTO1]  -50.72,57.31 0 top
OC2  1200980560**OPTOCOUPLER SMD PS2561DL2-1Y-V-F3-A/L CTR Rank:L  [PS2561DL2-1_OPTO1]  -45.93,57.28 0 top
PCB1  0369-6476**PCB [ARGE?] SDA381CF416M3HFS2(123x113.2)  [PCB]  -109.78,128.43 0 top
PROG1  NC**TAKILMAYACAK  [PROG_6PIN]  -72.74,37.17 180 bottom
Q1  1200980090**TRANS SMD NPN BC847B SOT-23  [SOT23]  -79.37,87.3 0 top
Q2  0109-4085**Mosfet N-Ch 600V 20.6A 190mohm TO-220 FCP190N60E  [TO220BV]  -67.48,108.19 0 top
Q3  0109-4088**Mosfet N-Ch 10.2A 650V Rds:380mR TO-220F Fairchild FCPF380N65FL1  [ISO_TO_220]  -45.31,105.71 0 top
Q4  0109-4088**Mosfet N-Ch 10.2A 650V Rds:380mR TO-220F Fairchild FCPF380N65FL1  [ISO_TO_220]  -32.54,105.71 0 top
Q9  1200980090**TRANS SMD NPN BC847B SOT-23  [SOT23]  -49.01,32.69 180 top
Q10  1200980090**TRANS SMD NPN BC847B SOT-23  [SOT23]  -51.22,21.9 270 top
Q14  1200980090**TRANS SMD NPN BC847B SOT-23  [SOT23]  -29.95,20.11 270 top
R1  NC**takılmayacak  [R0603_ENKO]  -29.21,81.41 90 top
R2  1200970516**RES 0603 22K %5 1/10W  [R0603_ENKO]  -29.21,84.38 90 top
R3  1200970518**RES 0603 10K %5 1/10W  [R0603_ENKO]  -29.64,87.38 270 top
R4  1029-6030**RES 0805 1K5 %1  [R0805_ENKO]  -45.49,82.52 90 top
R5  1200970158**RES 1206 220K %5 1/4W  [R1206]  -77.64,72.74 0 top
R6  1200970158**RES 1206 220K %5 1/4W  [R1206]  -73.91,74.21 90 top
R7  1029-2336**RES 0603 68K %1  [R0603_ENKO]  -81.95,91.75 180 top
R8  1200970569**RES 0603 33K %5 1/10W  [R0603_ENKO]  -76.84,88.01 90 top
R9  1200970934**RES 0603 470K %1 1/10W  [R0603_ENKO]  -72.31,82.21 180 top
R10  1029-2335**RES 0603 33K %1  [R0603_ENKO]  -69.71,85.26 270 top
R11  1200970528**RES 0603 0R %5 1/10W  [R0603_ENKO]  -74.16,91.29 0 top
R12  1029-2005**RES 0603 220R %1  [R0603_ENKO]  -67.43,86.85 0 top
R13  1029-2203**RES 0603 12K %1  [R0603_ENKO]  -59.25,92.51 90 top
R14  1029-2335**RES 0603 33K %1  [R0603_ENKO]  -74.73,88.09 90 top
R15  1200971020**RES 0603 10K %1 1/10W  [R0603_ENKO]  -63.98,89.02 90 top
R16  NC**Takılmayacak  [R0603_ENKO]  -63.97,92.49 90 top
R17  1029-6014**RES 2512 0R010 %1 1W  [R2512]  -78.79,83.23 0 top
R18  1029-6014**RES 2512 0R010 %1 1W  [R2512]  -76.44,78.93 0 top
R19  1200970116**RES 0805 0R %5  [R0805_ENKO]  -37.03,90.34 180 top
R20  1200970528**RES 0603 0R %5 1/10W  [R0603_ENKO]  -31.08,90.77 90 top
R21  1029-2006**RES 0603 47R %1  [R0603_ENKO]  -70.66,96.35 180 top
R22  1200970518**RES 0603 10K %5 1/10W  [R0603_ENKO]  -67.27,96.35 0 top
R23  NC**Takılmayacak  [R1206_ENKO]  -75.46,99.19 0 top
R24  NC**Takılmayacak  [R0603_ENKO]  -46.3,69.12 180 top
R25  NC**Takılmayacak  [R1206_ENKO]  -75.46,101.56 0 top
R26  NC**Takılmayacak  [R1206_ENKO]  -75.45,103.92 0 top
R27  NC**Takılmayacak  [R1206_ENKO]  -90.43,103.93 180 top
R28  NC**Takılmayacak  [R1206_ENKO]  -90.47,99.15 180 top
R29  NC**Takılmayacak  [R1206_ENKO]  -90.46,101.53 180 top
R30  NC**Takılmayacak  [R1206_ENKO]  -75.45,96.82 0 top
R31  1029-3039**RES 0805 68R %5  [R0603_ENKO]  -34.41,90.78 270 top
R32  1200970449**RES 0805 5K1 %1 1/8W  [R0805_ENKO]  -119.54,40.88 90 top
R33  1200970587**RES 1206 470K %5 1/4W  [R1206_ENKO]  -59.75,102.63 90 top
R34  1200970587**RES 1206 470K %5 1/4W  [R1206_ENKO]  -62.13,99.55 90 top
R35  1200970179**RES 1206 330K %5 1/4W  [R1206_ENKO]  -59.67,96.49 90 top
R36  1029-2203**RES 0603 12K %1  [R0603_ENKO]  -60.81,92.5 90 top
R37  1200970738**RES 0603 22K %1 1/10W  [R0603_ENKO]  -57.71,89.01 180 top
R38  1200970738**RES 0603 22K %1 1/10W  [R0603_ENKO]  -55.4,88.34 270 top
R39  NC**TAKILMAYACAK  [R1206_ENKO]  -18.94,43.24 180 top
R40  NC**TAKILMAYACAK  [R1206_ENKO]  -49.89,47.7 180 top
R44  1200970118**RES 0805 100R %5 1/8W  [R0805_ENKO]  -45.24,74.93 0 top
R45  1409-0025**RES 0603 470R %5 1/16W  [R0603_ENKO]  -53.89,43.37 0 top
R46  1200970228**RES 1206 47R %5 1/4W  [R1206_ENKO]  -38.42,99.36 90 top
R47  1029-2006**RES 0603 47R %1  [R0603_ENKO]  -49.46,96.82 180 top
R48  1200970832**RES 0603 220K %1 1/10W  [R0603_ENKO]  -41.05,100.32 0 top
R49  1200970803**RES 0603 100K %1 1/10W  [R0603_ENKO]  -41.11,98.31 180 top
R50  1029-2003**RES 0603 10R %1  [R0603_ENKO]  -44.07,97.7 180 top
R51  1200970158**RES 1206 220K %5 1/4W  [R1206]  -82.64,72.74 0 top
R52  1200970803**RES 0603 100K %1 1/10W  [R0603_ENKO]  -49.1,25 90 top
R53  1200971020**RES 0603 10K %1 1/10W  [R0603_ENKO]  -49.78,27.61 0 top
R54  1029-2003**RES 0603 10R %1  [R0603_ENKO]  -75.72,20.94 225 top
R55  NC**TAKILMAYACAK  [R1206_ENKO]  -49.88,45.31 180 top
R56  NC**Takılmayacak  [R1206_ENKO]  -49.9,42.94 180 top
R57  1200970124**RES 0805 10K %5 1/8W  [R0805_ENKO]  -65.5,15.5 315 top
R58  1200970803**RES 0603 100K %1 1/10W  [R0603_ENKO]  -45.92,28.54 180 top
R59  1200970770**RES 0603 4K3 %1 1/10W  [R0603_ENKO]  -45.91,30.12 0 top
R61  1200970940**RES 0603 6K8 %1 1/10W  [R0603_ENKO]  -76.09,52.03 90 top
R62  1200970568**RES 0603 47K %5 1/10W  [R0603_ENKO]  -42.13,38.29 270 top
R63  1200971020**RES 0603 10K %1 1/10W  [R0603_ENKO]  -43.73,38.29 270 top
R64  1200970516**RES 0603 22K %5 1/10W  [R0603_ENKO]  -45.32,38.28 270 top
R65  1029-2234**RES 0603 4K7 %1  [R0603_ENKO]  -74.48,51.12 270 top
R66  1200970583**RES 0603 1K %1 1/10W  [R0603_ENKO]  -58.75,44.55 180 top
R67  1169-1001**TSM2A103F3951RZ THINKING 0805 10K NTC 125C  [R0805_ENKO]  -56.53,37.38 270 top
R68  NC**TAKILMAYACAK  [R0603_ENKO]  -77.98,23.17 45 top
R69  NC**TAKILMAYACAK  [R1206_ENKO]  -19.02,41.06 180 top
R70  NC**TAKILMAYACAK  [R1206_ENKO]  -19.07,38.67 180 top
R71  1029-2005**RES 0603 220R %1  [R0603_ENKO]  -72.76,41.33 270 top
R72  NC**TAKILMAYACAK  [R1206_ENKO]  -92.17,1.86 0 top
R73  1029-2005**RES 0603 220R %1  [R0603_ENKO]  -72.95,43.63 180 top
R74  1200970519**RES 0603 4K7 %5 1/10W  [R0603_ENKO]  -87.48,9.64 90 top
R75  1029-3164**RES 1206 120R %1  [R1206_ENKO]  -92.17,4.25 0 top
R76  1200970519**RES 0603 4K7 %5 1/10W  [R0603_ENKO]  -87.61,6.55 180 top
R77  1200970601**RES 1206 10R %5 1/4W  [R1206_ENKO]  -92.83,12.34 270 top
R78  1200970626**RES 0603 82K %1 1/10W  [R0603_ENKO]  -73.31,46.89 270 top
R79  1029-2005**RES 0603 220R %1  [R0603_ENKO]  -70.38,45.32 90 top
R80  1200970568**RES 0603 47K %5 1/10W  [R0603_ENKO]  -28.81,37.74 270 top
R81  1200971020**RES 0603 10K %1 1/10W  [R0603_ENKO]  -30.38,37.73 270 top
R82  1200970516**RES 0603 22K %5 1/10W  [R0603_ENKO]  -31.97,37.72 270 top
R84  1200970518**RES 0603 10K %5 1/10W  [R0603_ENKO]  -62.26,25.47 0 top
R85  1200970522**RES 0603 1K %5 1/10W  [R0603_ENKO]  -45.89,34.98 180 top
R86  1319-4060**Ferrite Bead SMD 0805 2kOhm@100MHz 300mA LAIRD HZ0805C202R-10  [R0805_ENKO]  -71.59,31.9 180 top
R87  1200970518**RES 0603 10K %5 1/10W  [R0603_ENKO]  -45.89,33.31 180 top
R88  1200970803**RES 0603 100K %1 1/10W  [R0603_ENKO]  -44.43,2.21 0 top
R89  1200970516**RES 0603 22K %5 1/10W  [R0603_ENKO]  -46.67,2.48 90 top
R90  1200970803**RES 0603 100K %1 1/10W  [R0603_ENKO]  -44.36,7.64 180 top
R91  120097058**RES 0603 1K %1 1/10W  [R0603_ENKO]  -43.27,9.23 0 top
R92  1200970583**RES 0603 1K %1 1/10W  [R0603_ENKO]  -42.18,11.03 180 top
R93  1200970706**RES 0603 1K8 %5 1/10W  [R0603_ENKO]  -38.3,11.09 180 top
R94  1200970522**RES 0603 1K %5 1/10W  [R0603_ENKO]  -72.64,38.43 90 top
R95  1200970927**RES 0603 100R %1 1/10W  [R0603_ENKO]  -31.01,14.05 180 top
R96  1200970528**RES 0603 0R %5 1/10W  [R0603_ENKO]  -31,12.37 180 top
R98  1029-6021**RES 2512 0R003 %1 2W  [R2512]  -19.81,21.43 210 top
R99  1200970583**RES 0603 1K %1 1/10W  [R0603_ENKO]  -31.12,10.77 0 top
R100  1200970522**RES 0603 1K %5 1/10W  [R0603_ENKO]  -45.27,11.92 270 top
R101  1200970522**RES 0603 1K %5 1/10W  [R0603_ENKO]  -46.73,11.91 90 top
R102  1029-2003**RES 0603 10R %1  [R0603_ENKO]  -41.58,14.9 270 top
R103  1200970803**RES 0603 100K %1 1/10W  [R0603_ENKO]  -31.14,9.17 180 top
R104  1029-2233**RES 0603 2K2 %1  [R0603_ENKO]  -52.37,14.04 90 top
R105  1200970518**RES 0603 10K %5 1/10W  [R0603_ENKO]  -57.09,53.08 90 top
R106  1200970156**RES 1206 22K %5 1/4W  [R1206_ENKO]  -50.15,40.57 180 top
R107  1200970584**RES 0603 18K %1 1/10W  [R0603_ENKO]  -53.92,53.07 90 top
R108  1200970583**RES 0603 1K %1 1/10W  [R0603_ENKO]  -47.82,19.34 0 top
R109  1200970584**RES 0603 18K %1 1/10W  [R0603_ENKO]  -55.5,53.08 90 top
R110  1200970803**RES 0603 100K %1 1/10W  [R0603_ENKO]  -34.77,11.12 180 top
R111  1029-6089**RES 0603 6K8 %5  [R0603_ENKO]  -52.4,17 90 top
R113  NC**Takılmayacak - 1029-2203**RES 0603 12K %1  [R0603_ENKO]  -40.41,19.54 180 top
R114  1029-2341**RES 0603 5K6 %1  [R0603_ENKO]  -39.2,17.97 180 top
R115  1200970802**RES 0603 3K3 %1 1/10W  [R0603_ENKO]  -36.22,17.73 180 top
R116  1200970522**RES 0603 1K %5 1/10W  [R0603_ENKO]  -51.65,19.43 180 top
R117  1200971020**RES 0603 10K %1 1/10W  [R0603_ENKO]  -51.56,24.31 180 top
R118  1200970522**RES 0603 1K %5 1/10W  [R0603_ENKO]  -54.67,36.65 90 top
R119  1200970689**RES 0603 3K3 %5 1/10W  [R0603_ENKO]  -52.21,28.2 270 top
R120  1169-1006**FUSE SMD 1206 PTC RESETTABLE 16V IHOLD=0.75A IMAX=100A  [R1206_ENKO]  -63.86,6.99 0 top
R123  1200970522**RES 0603 1K %5 1/10W  [R0603_ENKO]  -53.92,45.38 180 top
R125  1200970193**RES 0805 4K7 %5 1/8W  [R0805_ENKO]  -82.66,38.79 180 top
R126  1029-2234**RES 0603 4K7 %1  [R0603_ENKO]  -80.13,39.14 270 top
R127  1029-2234**RES 0603 4K7 %1  [R0603_ENKO]  -78.54,39.14 90 top
R128  1200970515**RES 0603 100K %5 1/10W  [R0603_ENKO]  -30.79,17.61 180 top
R129  1029-6086**RES 0603 22R %1  [R0603_ENKO]  -62.99,13.27 270 top
R130  1029-6086**RES 0603 22R %1  [R0603_ENKO]  -61.54,16.65 90 top
R131  1200970852**RES 0603 1K5 %5 1/10W ( <-1029-3501 )  [R0603_ENKO]  -65.27,21.58 270 top
R132  1200971020**RES 0603 10K %1 1/10W  [R0603_ENKO]  -34.27,20.01 270 top
R134  1200970528**RES 0603 0R %5 1/10W  [R0603_ENKO]  -76.85,22.07 45 top
R135  1200970516**RES 0603 22K %5 1/10W  [R0603_ENKO]  -63.72,23.86 180 top
R136  1029-2234**RES 0603 4K7 %1  [R0603_ENKO]  -74.9,31.86 0 top
R137  1200970684**RES 0603 47K %1 1/10W  [R0603_ENKO]  -74.9,30.48 0 top
R138  1200970583**RES 0603 1K %1 1/10W  [R0603_ENKO]  -80.01,27.55 180 top
R141  1200970522**RES 0603 1K %5 1/10W  [R0603_ENKO]  -30,22.55 180 top
R142  1200970518**RES 0603 10K %5 1/10W  [R0603_ENKO]  -32.7,20.01 270 top
R143  1029-2229**RES 0603 120K %1  [R0603_ENKO]  -82.7,33.37 90 top
R144  1029-2337**RES 0603 39K %1  [R0603_ENKO]  -33.02,22.68 180 top
R145  1200970687**RES 0603 56K %1 1/10W  [R0603_ENKO]  -80.01,29.15 0 top
R146  1200970585**RES 0603 1M %5 1/10W  [R0603_ENKO]  -27.73,22.71 270 top
R147  1200970730**RES 0603 560R %1 1/10W  [R0603_ENKO]  -72.55,28.63 315 top
R148  1029-3066**RES 0805 56K %5  [R0805_ENKO]  -47.23,25.22 270 top
R193  1200970934**RES 0603 470K %1 1/10W  [R0603_ENKO]  -74.23,56.62 270 top
R194  1200970528**RES 0603 0R %5 1/10W  [R0603_ENKO]  -67.48,55.72 0 top
RL1  1200930051**RELAY SPST 12V 5A 7x15x20.3mm  [ALD1_AND_ALJ_RELAY]  -57.16,24 270 top
T1  1109-1016**Transistor NPN 3A 100V 15W Hfemin:10 DPAK Diodes MJD31C-13  [DPAK]  -37.76,83.14 270 top
T2  1109-4205**Mosfet N-Ch 220mA 50V Rds:1.16R SOT-23 INFINEON BSS138  [SOT-23]  -72.36,84.69 90 top
T3  1200980091**TRANS SMD PNP BC857B SOT-23  [SOT23-BEC]  -44.3,4.91 180 top
T4  NC**Takılmayacak  [SOT-23]  -73.66,19.04 45 top
T5  1200980539**TRANS SM PNP NSS1C200LT1G SOT-23 100V 3A  [SOT23-BEC]  -44.69,25.3 0 top
T6  1109-4205**Mosfet N-Ch 220mA 50V Rds:1.16R SOT-23 INFINEON BSS138  [SOT-23]  -42.31,71.92 0 top
TP2  PTR1TP20R  [TP20R]  -65.37,35.4 270 bottom
TRF2  Stok Dışı - E34/14/9 Lm=380uH P=28 S1=4 S2=4 Paux=3  [E34/14/9]  -22.56,63.17 180 top
TVS1  1119-3061**5V 130W TVS Diode SOD-323  [SOD323]  -62.26,10.03 90 top
U1  UCC28180  [UCC28180]  -67.83,91.13 0 top
U2  Stok Dışı -0077930A7 81 tur  [IND_TOROID]  -95.48,77.32 90 top
U3  [SOIC16_UCC256301]  -45.57,91.61 0 top
U4  1039-2392**LMR16006XDDCR 0.6A, 0.7MHz Step-Down Converter in a TSOT-6L, Input 4V to 60V  [AOZ1282CI-1]  -71.34,56.48 180 top
U5  1039-2220**STM32F072C8T6 64K Flash USB, CAN  [STM32F072CXXX_LQFP48]  -66.54,40.09 0 top
U13  1039-2388**5V 300mA ULDO Voltage Regulator SOT23-3  [AP2210N-5.0TRG1_SOT23-3]  -90.08,12.35 90 top
U$1  [EN-KO_AMLEMI]  -72.19,62.4 0 top
U$2  [ROHS]  -30.42,59.8 0 top
U$3  [FT-ICT]  -12.48,59.12 0 bottom
U$4  [ROHS]  -106.91,81.19 0 bottom
U$5  [EN-KO_AMLEMI]  -58.65,101.75 0 bottom
U$6  [SERI_NO_ETIKET_ALANI]  -79.95,74.81 0 bottom
VR1  0169-3008**Varistor 20mm 360VAC 470VDC (AbC)  [S20K40]  -103.56,22.86 90 top
X1  GMSTBA3  [GMSTBA3]  -106.49,0.91 0 top
X2  MSTBA3  [MSTBA3]  -77.28,0.91 0 top
X5  MSTBA7  [MSTBA7]  -23.88,0.91 0 top
X7  [USB_B(YATIK)]  -53.73,5 90 top
XK1  0289-9242**2EDGKA-7.62-03P-14-00SH  [SOKET]  -113.59,128.43 0 top
XK2  0289-9132**2EDGKA-5.08-04P-14  [SOKET]  -117.4,128.43 0 top
XK3  0289-9011**2EDGKA-5.08-03P-14  [SOKET]  -121.21,128.43 0 top
XK7  0309-2055**MJ-03-01-A1 MINIJUMPER(1308-2P)  [SOKET]  -123.75,128.04 0 top
Y1  1149-0013**CRYSTAL 16Mhz 10pF ±10ppm 120Ohm 4-SMD 2x1.6mm -40°C ~ 85°C  [NX2016SA-32M]  -68.25,31.68 90 top
Z1  1129-1145**ZENER SOT23 0.3W 15V BZX84C15  [SOT23]  -45.8,78.53 0 top
Z2  1129-1152**ZENER SOT23 10V 0.4W BZX84-C10  [SOT23]  -82.02,88.87 180 top
Z3  1129-1150**ZENER SOT23 6V2 225mW BZX84C6V2 (AbC)  [SOT23]  -45.63,71.93 0 top
Z4  1129-1162**ZENER SOT23 3V9 300mW BZX84C3V9  [SOT23]  -59.84,56.16 270 top
Z5  ZENER SOT23 33V 0.4W  [SOT23]  -54.01,48.15 0 top
Z8  1129-1160**ZENER SOT23 12V 300mW BZX84C12V (AbC)  [SOT23]  -30.09,25.21 0 top
Z9  1129-1140**ZENER SOT23 5V1 0.4W BZX84C5V1  [SOT23]  -26.04,20.46 90 top

## Tracks (layer width: path | path; a pad name or v marks a point on that pad's centre or on a via)
5.CANL  (via drill 0.35)
  Top 0.254: L3.1 -93.3,8.41 -92.9,8.81 -92.26,8.81 | -92.26,8.81 -91.93,8.81 v-91.67,9.07 | -92.26,8.81 -91.67,8.81 v-91.67,9.07 | -92.26,8.81 -91.86,9.24 v-91.67,9.07
  Top 0.305: L3.1 -93.32,8.24 -93.33,8.24 | v-79.89,11.94 -79.8,12.04 -79.26,12.04 | -79.26,12.04 -76.45,12.04 -75.88,11.47 -74.74,11.47 -74.2,12 -72.5,12 IC1.5 | -79.26,12.04 -79.85,12.16 v-79.89,11.94 | -79.26,12.04 -79.78,11.74 v-79.89,11.94
  Bottom 0.305: -91.24,9.54 -88.31,12.47 -80.42,12.47 -80.35,12.39 | -91.24,9.54 -91.67,9.1 v-91.67,9.07 | v-79.89,11.94 -80.35,12.39 | -91.24,9.54 -91.77,9.27 v-91.67,9.07 | -91.24,9.54 -91.46,8.98 v-91.67,9.07 | -80.35,12.39 -80.1,11.85 v-79.89,11.94 | -80.35,12.39 -79.8,12.15 v-79.89,11.94
30V  (via drill 0.35)
  Top 0.305: v-6.44,32.53 v-6.45,32.52 | v-6.11,45.92 v-6.11,45.91 | R193.2 -74.45,55.83 -76.06,57.44 C62.2 -77.09,57.44 | -77.09,57.44 -77.44,57.44 C111.1 | -52.95,53.22 -52.71,53.46 v-52.71,53.74 | -52.95,53.22 -53,53.17 | -53,53.17 -53.9,52.27 R107.1 | -47.77,25.51 -47.23,26.05 R148.1 -45.96,27.54 | -47.77,25.51 -49.07,24.2 R52.1 | -45.96,27.54 -43.99,27.54 -41.14,24.68 -38.96,24.68 | v-38.32,24.68 -38.96,24.68 | -46.28,53.65 -46.84,53.09 -46.84,51.83 | -45.45,53.53 -45.45,53.65 | -47.77,25.51 -47.77,26.33 -47.8,26.36 | -45.96,27.54 -46.35,27.54 | -46.35,27.54 -47.31,26.58 | -46.35,27.54 -46.66,27.54 -47.59,26.6 | -53,53.17 -52.56,53.57 | v-52.71,53.74 -52.56,53.57 | -52.95,53.22 -52.89,53.76 v-52.71,53.74 | -53,53.17 -52.97,53.2 -52.96,53.21 | -52.96,53.21 -52.56,53.57 | v-52.71,53.74 -52.56,53.57 | -52.96,53.21 -52.9,53.76 v-52.71,53.74 | -38.96,24.68 -38.4,24.47 v-38.32,24.68 | -38.96,24.68 -38.4,24.9 v-38.32,24.68 | -77.09,57.44 -78.2,57.48 | -77.09,57.44 -77.44,56.39
  Top 0.508: R193.2 -74.06,55.83 -73.42,56.48 U4.5
  Top 0.61: C65.1 -14.93,34.29 v-14.35,33.71 -13.6,32.96 C61.1 | C59.1 v-6.44,32.53 | R113.2 -41.33,19.42 v-42.33,19.42 | C108.2 -6.1,45.93 v-6.11,45.92
  Top 0.813: -45.45,53.65 -46.28,53.65 -46.73,53.65 -47.2,53.18 OC2.1 -47.2,51.96 -45.69,53.47 -45.63,53.47 -45.45,53.65 | -45.45,53.65 -42.62,53.65 -42,53.03 C24.P$2
  Bottom 0.305: -12.06,49.97 -12.06,45.81 | -12.06,45.81 -12.06,41.15 | -12.06,41.15 | -12.06,41.15 C48.+ -12.06,37.84 | -12.06,37.84 | -12.06,37.84 -12.06,33.62 | -12.06,33.62 -12.06,32.4 | -12.06,32.4 -12.06,27.06 | -12.06,27.06 -12.06,26.2 | -12.06,26.2 -12.06,25.57 C45.+ -11.91,23.77 | -11.91,23.77 | -11.91,23.77 -11.91,21.11 -14.37,18.64 -14.3,18.57 | -14.3,18.57 -15.05,17.82 | -15.05,17.82 L6.1 | C41.+ -35.65,27.44 | -35.65,27.44 | -35.65,27.44 -24.65,27.44 | -24.65,27.44 -23.45,27.44 C58.+ -21.39,27.84 | -21.39,27.84 | -21.39,27.84 -13.71,27.84 -12.72,26.86 | -12.72,26.86 -12.06,26.2 | v-14.35,33.71 -13.71,33.71 | -13.71,33.71 -12.16,33.71 -12.06,33.62 | v-6.45,32.52 -7.09,32.52 | -7.09,32.52 -11.94,32.52 -12.06,32.4 | -13.25,17.7 -13.43,17.7 -14.3,18.57 | v-6.11,45.91 -6.75,45.91 | -6.75,45.91 -11.96,45.91 -12.06,45.81 | v-52.71,53.74 -52.74,53.71 -52.74,53.1 | -52.74,53.1 -52.74,52.53 | -41.69,19.42 -39.6,19.42 -38.32,20.7 -38.32,24.04 | -41.69,19.42 v-42.33,19.42 | v-38.32,24.68 -38.32,24.04 | -41.69,19.42 -42.25,19.63 v-42.33,19.42 | -41.69,19.42 -42.25,19.2 v-42.33,19.42 | -13.71,33.71 -14.27,33.93 v-14.35,33.71 | -13.71,33.71 -14.27,33.5 v-14.35,33.71 | -7.09,32.52 -6.53,32.31 v-6.45,32.52 | -7.09,32.52 -6.53,32.73 v-6.45,32.52 | -6.75,45.91 -6.18,45.7 v-6.11,45.91 | -6.75,45.91 -6.18,46.13 v-6.11,45.91 | -52.74,53.1 -52.51,53.65 v-52.71,53.74 | -52.74,53.1 -52.93,53.67 v-52.71,53.74 | -38.32,24.04 -38.11,24.61 v-38.32,24.68 | -38.32,24.04 -38.53,24.61 v-38.32,24.68 | -35.65,27.44 -36.55,28.26 | -35.65,27.44 | -35.65,27.44 -36.55,26.62 | -35.65,27.44 -36.55,28.26 | -36.55,28.26 | -35.65,27.44 -36.55,26.62 | -35.65,27.44 -36.55,28.26
  Bottom 0.305: -35.65,27.44 -36.55,26.62 | -11.91,23.77 | -11.91,23.77 -11.09,24.66 | -11.91,23.77 -12.73,24.66 | -12.06,27.06 -12.8,26.1 | -12.06,27.06 -11.16,26.25 | -11.91,23.77 -11.09,24.66 | -11.09,24.66 | -11.91,23.77 -12.73,24.66 | -11.91,23.77 -11.09,24.66 | -11.91,23.77 -12.73,24.66 | -12.72,26.86 -13,25.67 | -12.72,26.86 -11.57,26.48 | -12.06,41.15 -12.89,40.25 | -12.06,41.15 | -12.06,41.15 -11.24,40.25 | -12.06,37.84 | -12.06,37.84 -11.24,38.74 | -12.06,37.84 -12.89,38.74 | -12.06,41.15 -12.89,40.25 | -12.89,40.25 | -12.06,41.15 -11.24,40.25 | -12.06,41.15 -12.89,40.25 | -12.06,41.15 -11.24,40.25 | -12.06,37.84 -11.24,38.74 | -11.24,38.74 | -12.06,37.84 -12.89,38.74 | -12.06,37.84 -11.24,38.74 | -12.06,37.84 -12.89,38.74 | -21.39,27.84 -22.29,28.67 | -21.39,27.84 | -21.39,27.84 -22.29,27.02 | -24.65,27.44 -23.58,26.86 | -24.65,27.44 -23.98,28.46 | -21.39,27.84 -22.29,28.67 | -22.29,28.67 | -21.39,27.84 -22.29,27.02 | -21.39,27.84 -22.29,28.67 | -21.39,27.84 -22.29,27.02 | -15.05,17.82 -16.28,17.68 | -15.05,17.82 -15.2,16.59
  Bottom 0.61: v-38.32,24.68 -38.32,25.53 | -38.32,25.53 -38.32,26.43 C41.+ | -38.32,25.53 -36.75,26.65 | -38.32,25.53 -38.27,27.46
  Bottom 1.5: C111.1 -78.23,57.77 -77.09,58.91 -69.7,58.91 -66.35,55.56 -61.82,55.56 -58.79,52.53 C24.P$2 -52.74,52.53
  pour Bottom (isolate 0.305, no thermals): -62.4,54.94 -59.02,51.56 -51.63,51.56 -44.43,44.36 -30.98,44.36 -28.38,41.81 -27.94,41.37 -21.17,41.37 -19.82,40.02 -19.82,33.59 -21.79,31.62 -34.93,31.62 -38.62,27.93 -38.62,25.71 -37.51,24.6 -22.61,24.6 -19.2,21.19 -19.2,15.93 -18.54,15.27 -12.02,15.27 -10.01,17.28 -2.48,17.28 -1.69,18.07 -1.69,64.37 -2.7,65.38 -27.4,65.38 -38.61,54.17 -55.24,54.17 -57.46,56.39 -66.28,56.39 -69.64,59.75 -77.95,59.75 -79.1,58.6 -79.1,56.33 -78.56,55.79 -77.92,55.79 -75.7,58.01 -69.71,58.01 -66.64,54.94
  pour Top (isolate 0.305, no thermals): -79.04,57.19 -78.58,57.65 -78.51,57.72 -75.92,57.72 -75.75,57.55 -75.75,57.3 -75.91,57.14 -76.38,57.14 -77.24,57.14 -77.42,56.96 -77.42,56.31 -77.9,55.83 -78.58,55.83 -78.8,56.05 -79.04,56.29
  pour Top (isolate 0.305, no thermals): -8.84,53.47 -8.52,53.15 -8.52,48.83 -8.73,48.62 -15.83,48.62 -16.18,48.97 -16.18,53.25 -15.99,53.44 -15.96,53.47
+3V3  (via drill 0.35)
  Top 0.254: -73.31,32.69 -72.7,32.08 -72.7,31.96 | -72.07,32.69 -72.64,32.12 R86.2 | C77.1 -71.09,33.4 -72.64,31.85 | -70.82,36.14 -71.29,35.67 -71.29,35.65
  Top 0.305: -65.43,4.8 LED1.2 -66.06,5.09 | -45.71,17.36 -46.09,17.36 -46.26,17.54 | v-46.72,17.99 -46.31,17.58 | -46.31,17.58 -46.26,17.54 | -44.24,17.36 -43.87,17.36 IC5.8 -43.74,17.86 -44.24,17.36 | -44.24,17.36 -45.54,17.36 | -45.54,17.36 -45.71,17.36 | -45.71,17.36 -45.86,17.51 | -45.86,17.51 -45.86,17.68 | -45.86,18.44 -45.86,19.15 C79.1 | -45.86,18.44 -45.86,17.85 | -70.27,28.97 -70.17,28.97 -69.58,28.38 -69.58,26 | -70.27,28.97 v-70.91,28.97 | D21.2 -69.58,26 | v-76.81,41.86 -76.54,42.13 -76.54,42.16 | -76.54,42.44 -76.54,43.46 -74.79,45.21 -72.46,45.21 -71.37,46.31 -71.37,46.87 | -76.54,42.44 -76.54,42.16 | -71.08,35.13 C76.1 -70.82,35.55 -70.82,36.14 -70.82,37.31 U5.48 | -66.01,47.55 C89.1 | -67.76,47.55 C88.1 | -72.7,32.69 -73.31,32.69 -73.56,32.94 -73.56,36.56 -73.75,36.75 -73.75,40.2 -74.6,41.05 -75.43,41.05 -76.17,41.79 | -72.7,32.69 -72.07,32.69 -71.09,33.67 C77.1 | R86.2 -72.7,31.96 -72.7,32.69 | C88.1 -68.04,48.01 -68.33,48.01 | -70.9,47.8 -70.69,48.01 -69.53,48.01 | -70.9,47.8 -71.15,47.56 | -71.15,47.56 -71.37,47.34 | -71.37,46.87 -71.37,47.34 | -68.33,48.01 -68.66,48.01 | -68.66,48.01 -68.81,48.01 | -68.81,48.01 -69.11,48.01 | -69.11,48.01 -69.32,48.01 | -69.32,48.01 -69.53,48.01 | U5.36 -69.29,45.89 | C88.1 -67.63,47.55 -67.86,47.32 | -67.86,47.32 -68.38,46.8 | -68.38,46.8 -68.58,46.6 | -68.58,46.6 -68.83,46.34 | -68.83,46.34 -69.08,46.09 | -69.08,46.09 -69.29,45.89 | -76.17,41.79 -76.24,41.86 | v-76.81,41.86 -76.24,41.86 | -59.69,43.02 C81.1 -60.5,42.84 U5.24 | -59.69,43.02 -58.76,43.02 | R66.2 -59.55,43.94 | -59.55,43.16 -59.69,43.02 | -71.37,47.34 -69.8,47.34 | -69.8,47.34 -68.5,47.34 | -68.5,47.34 -68.14,47.34
  Top 0.305: -68.14,47.34 -67.88,47.34 -67.86,47.32 | -68.33,48.01 -68.14,47.82 -68.14,47.49 | -68.14,47.49 -68.14,47.34 | -68.66,48.01 -68.37,47.73 | -68.37,47.73 -68.14,47.49 | -68.37,47.73 -68.37,47.47 -68.38,47.47 | -68.38,47.47 -68.5,47.34 | -68.38,46.8 -68.38,47.47 | -68.58,46.6 -68.58,47.78 -68.81,48.01 | -68.83,46.34 -68.83,47.74 -69.11,48.01 | -69.08,46.09 -69.08,47.78 -69.32,48.01 | -69.29,45.89 -69.29,46.83 | -69.29,46.83 -69.29,47.49 | -69.29,47.49 -69.29,47.78 | -69.29,47.78 -69.53,48.01 | -70.9,47.8 -70.88,47.78 -69.29,47.78 | -71.15,47.56 -70.74,47.56 | -70.74,47.56 -69.36,47.56 -69.29,47.49 | -69.8,47.34 -69.62,47.16 | -71.37,46.87 -71.07,47.16 | -71.07,47.16 -70.74,47.5 -70.74,47.56 | -71.07,47.16 -69.62,47.16 | -69.62,47.16 -69.29,46.83 | v-46.72,17.99 -46.31,17.99 | -46.31,17.99 -46.17,17.99 | -46.17,17.99 -46.07,17.99 | -46.07,17.99 -46,17.99 | -46,17.99 -45.86,17.85 | -45.86,17.51 -45.93,17.58 -46.15,17.58 | -46.15,17.58 -46.22,17.58 | -46.22,17.58 -46.31,17.58 | -46,17.99 -46,17.82 | -46.15,17.58 -46,17.73 -46,17.82 | -46.31,17.99 -46.31,17.74 -46.19,17.62 | -46.19,17.62 -46.15,17.58 | -46.17,17.99 -46.08,17.9 | -46.08,17.9 -46,17.82 | -45.86,17.85 -45.86,17.68 | -45.86,17.68 -45.54,17.36 | -46.31,17.99 -46.1,18.2 | -46.1,18.2 -45.86,18.44 | -76.24,41.86 -76.54,42.16 | -69.58,26 -69.91,25.67 -69.91,25.6 | -64.06,15.46 -64.06,14.19 | -64.06,14.19 -64.06,13.71 v-64.2,13.56 | -59.55,43.58 -60.89,43.58 -60.91,43.6 | -59.55,43.94 -59.85,43.64 -60.91,43.64 | -60.91,43.64 -60.95,43.64 | -59.55,43.94 -59.55,43.85 C82.1 | -46.1,18.2 | -46.26,17.54 -46.51,18.08 v-46.72,17.99 | -46.26,17.54 -46.81,17.78 v-46.72,17.99 | -46.07,17.99 -46.64,18.2 v-46.72,17.99
  Top 0.305: -46.07,17.99 -46.64,17.78 v-46.72,17.99 | -46.22,17.58 -46.52,18.1 v-46.72,17.99 | -46.22,17.58 -46.79,17.78 v-46.72,17.99 | -46.19,17.62 -46.53,18.12 v-46.72,17.99 | -46.19,17.62 -46.77,17.77 v-46.72,17.99 | -46.08,17.9 -46.61,18.19 v-46.72,17.99 | -46.08,17.9 -46.67,17.77 v-46.72,17.99 | -46.1,18.2 -46.71,18.22 | -46.71,18.22 | v-46.72,17.99 -46.71,18.22 | -46.1,18.2 -46.57,17.82 | v-46.72,17.99 -46.57,17.82 | -46.1,18.2 -46.71,18.22 | v-46.72,17.99 -46.71,18.22 | -46.1,18.2 -46.57,17.82 | v-46.72,17.99 -46.57,17.82 | -64.06,14.19 -64.39,13.69 v-64.2,13.56 | -64.06,14.19 -63.98,13.59 v-64.2,13.56 | -60.91,43.6 -61.46,43.85 v-61.55,43.64 | -60.91,43.6 -61.48,43.42 v-61.55,43.64 | -60.91,43.64 -61.47,43.85 v-61.55,43.64 | -60.91,43.64 -61.47,43.43 v-61.55,43.64 | -70.27,28.97 -70.83,29.18 v-70.91,28.97 | -70.27,28.97 -70.83,28.76 v-70.91,28.97 | -76.54,42.44 -76.96,42.02 v-76.81,41.86 | -76.54,42.44 -76.58,41.84 v-76.81,41.86 | -76.17,41.79 -76.7,42.06 v-76.81,41.86 | -76.17,41.79 -76.75,41.64 v-76.81,41.86
  Top 0.406: v-58.63,48.9 -58.8,48.72 | R66.2 -59.55,44.8 -58.82,45.52 -58.82,48.29 | v-58.63,48.9 -58.82,48.71 -58.82,48.29 | -58.82,48.29 -58.48,48.8 v-58.63,48.9 | -58.82,48.29 -58.8,48.91 v-58.63,48.9
  Top 0.61: -60.76,51.76 IC9.3 -59.51,52.26 | -60.76,51.76 C113.1 -59.51,52.26 | -59.51,52.26 -58.69,52.26 C109.1 | C82.1 -58.76,43.02 C81.1 -60.91,43.6 -60.95,43.64 v-61.55,43.64 | -59.55,43.16 -59.55,43.58 -59.55,43.94 -59.55,44.8 | LED1.2 -66.1,4.47 v-66.1,3.65 | v-64.2,13.56 -64.2,14.2 R57.2 -64.06,15.46 -63.7,15.81 FB1.1 | R131.2 -65.16,20.68 v-63.93,20.68 v-63.92,20.66 | R84.1 -63.43,25.1 v-64.82,25.1 -64.46,24.74 -64.46,23.91 R135.2 -64.51,24.1 -63.49,25.12 | R86.2 -72.64,31.85 -72.64,30.72 v-72.21,30.29 | C77.1 -71.09,35.12 -71.08,35.13 | C88.1 -66.01,47.55 | C89.1 -64.59,47.57 v-62.29,45.27 | -69.58,24.82 D21.2 -70.36,24.32 v-70.36,23.63 | v-62.15,51.69 -62.08,51.76 -60.76,51.76
  Bottom 0.305: v-70.36,23.63 v-70.36,23.62 | v-46.72,17.99 -47.36,17.99 | -47.36,17.99 -49.57,17.99 -53.41,21.83 -57.18,21.83 -58.83,23.48 -60.05,23.48 -61.95,21.57 -63.45,21.57 | v-64.2,13.56 -63.95,13.81 -63.95,14.16 | v-64.2,13.56 -64.12,13.56 -63.92,13.37 -63.92,13.02 | -63.92,12.98 -63.92,12.34 -64.4,11.86 -65.16,11.86 -67.9,14.61 -67.9,18.47 -70.36,20.93 -70.36,22.99 | -63.92,12.98 -63.92,13.02 | v-64.82,25.1 | v-66.1,3.65 -66.33,3.88 | -66.33,4.25 -66.33,9.3 -72.81,15.78 -72.81,17.75 -75.36,20.3 -76.07,20.3 -78.81,23.04 -78.81,35.4 -76.36,37.85 -76.36,41.35 -76.39,41.37 | v-76.81,41.86 -76.81,41.79 -76.39,41.37 | v-63.92,20.66 -63.95,20.64 -63.95,20.02 | -63.95,20.02 -63.95,14.16 | v-64.82,25.1 -64.36,24.64 | -64.36,24.64 -63.93,24.21 -63.93,22.05 | -63.93,22.05 -63.93,21.5 | -63.93,21.5 -63.93,21.31 | -63.93,21.31 v-63.93,20.67 v-63.92,20.66 | PROG1.1 -72.66,30.75 | -72.66,30.75 v-72.21,30.29 | -63.45,21.57 -63.59,21.72 | -63.59,21.72 -63.93,22.05 | -63.45,21.57 -63.74,21.28 | -63.74,21.28 -63.92,21.1 v-63.92,20.66 | -63.59,21.72 -63.71,21.72 -63.93,21.5 | v-70.36,23.63 -70.36,22.99 | -66.33,3.88 -66.33,3.65 v-66.1,3.65 | -66.33,4.25 -66.33,3.88 | -66.33,4.25 -65.93,3.8 v-66.1,3.65 | -70.39,23.07 -70.2,23.57 v-70.36,23.63 | -70.36,22.99 -70.39,23.07 | -70.39,23.07 -70.57,23.55 v-70.36,23.63 | -47.36,17.99 -46.79,17.78 v-46.72,17.99 | -47.36,17.99 -46.79,18.2 v-46.72,17.99 | -63.92,12.98 -63.98,13.58 v-64.2,13.56 | -63.92,13.02 -64.34,13.42 v-64.2,13.56 | -63.95,14.16 -64.36,13.72 v-64.2,13.56 | -63.95,14.16 -63.97,13.55 v-64.2,13.56 | -63.95,20.02 -63.71,20.58 v-63.92,20.66 | -63.95,20.02 -64.14,20.59 v-63.92,20.66
  Bottom 0.305: -63.93,21.31 -64.13,20.74 v-63.92,20.66 | -63.93,21.31 -63.71,20.75 v-63.92,20.66 | -63.74,21.28 -64.1,20.8 v-63.92,20.66 | -63.74,21.28 -63.7,20.68 v-63.92,20.66 | -64.36,24.64 -64.61,25.19 v-64.82,25.1 | -64.36,24.64 -64.91,24.89 v-64.82,25.1 | -76.39,41.37 | -76.45,41.41 -76.64,41.92 v-76.81,41.86 | -76.39,41.37 | -76.39,41.37 -76.92,41.66 | v-76.81,41.86 -76.92,41.66 | -76.47,41.42 -76.65,41.92 | -76.39,41.37 -76.45,41.41 | -76.45,41.41 -76.47,41.42 | -76.47,41.42 -76.92,41.66 | -76.92,41.66 | -76.45,41.41 -76.64,41.92 -76.65,41.92 | v-76.81,41.86 -76.65,41.92 | -76.39,41.37 -76.45,41.41 | -76.45,41.41 -76.92,41.66 | v-76.81,41.86 -76.92,41.66 | -72.66,30.75 -72.42,30.2 v-72.21,30.29 | -72.66,30.75 -72.12,30.5 v-72.21,30.29
  Bottom 0.61: v-62.15,51.69 -62.13,51.69 -59.36,48.92 -58.65,48.92 v-58.63,48.9 | v-70.91,28.97 -72.21,30.27 v-72.21,30.29 | v-62.29,45.27 -61.55,44.53 v-61.55,43.64
+5V/1  (via drill 0.35)
  Top 0.305: -88.8,9.79 C134.1 -89.13,9.77 | v-87.99,11.62 -87.99,11.6 | -79.78,8.57 -80.24,8.57 v-80.41,8.73 | -79.78,8.57 -75.38,8.57 | -75.38,8.57 -74.88,9.07 C46.2 -74.6,8.82 -70.09,8.82 | -70.09,8.82 IC1.8 | -75.38,8.57 -70.34,8.57 -70.09,8.82 | -79.78,8.57 -80.28,8.91 v-80.41,8.73 | -79.78,8.57 -80.38,8.51 v-80.41,8.73
  Top 0.61: C134.1 -88.98,10.52 | -88.98,10.52 -88.98,10.89 | -88.98,10.89 U13.2 | R74.2 -87.57,10.52 -88.09,10.52 | -88.09,10.52 -88.98,10.52 | v-87.99,11.62 -87.99,10.98 | -87.99,10.98 -87.99,10.62 -88.09,10.52 | -87.99,10.98 -88.08,10.89 -88.98,10.89
  Bottom 0.305: v-80.41,8.73 -80.78,8.73 -81.01,8.96 | -81.01,8.96 -83.67,11.62 -87.35,11.62 | v-87.99,11.62 -87.35,11.62 | -87.35,11.62 -87.91,11.83 v-87.99,11.62 | -87.35,11.62 -87.91,11.41 v-87.99,11.62 | -81.01,8.96 -80.55,8.56 v-80.41,8.73 | -81.01,8.96 -80.41,8.96 v-80.41,8.73
+12V  (via drill 0.35)